# Altium schematic sheet Sheet1.SchDoc
size A4; SheetNumber: 1; SheetTotal: 1
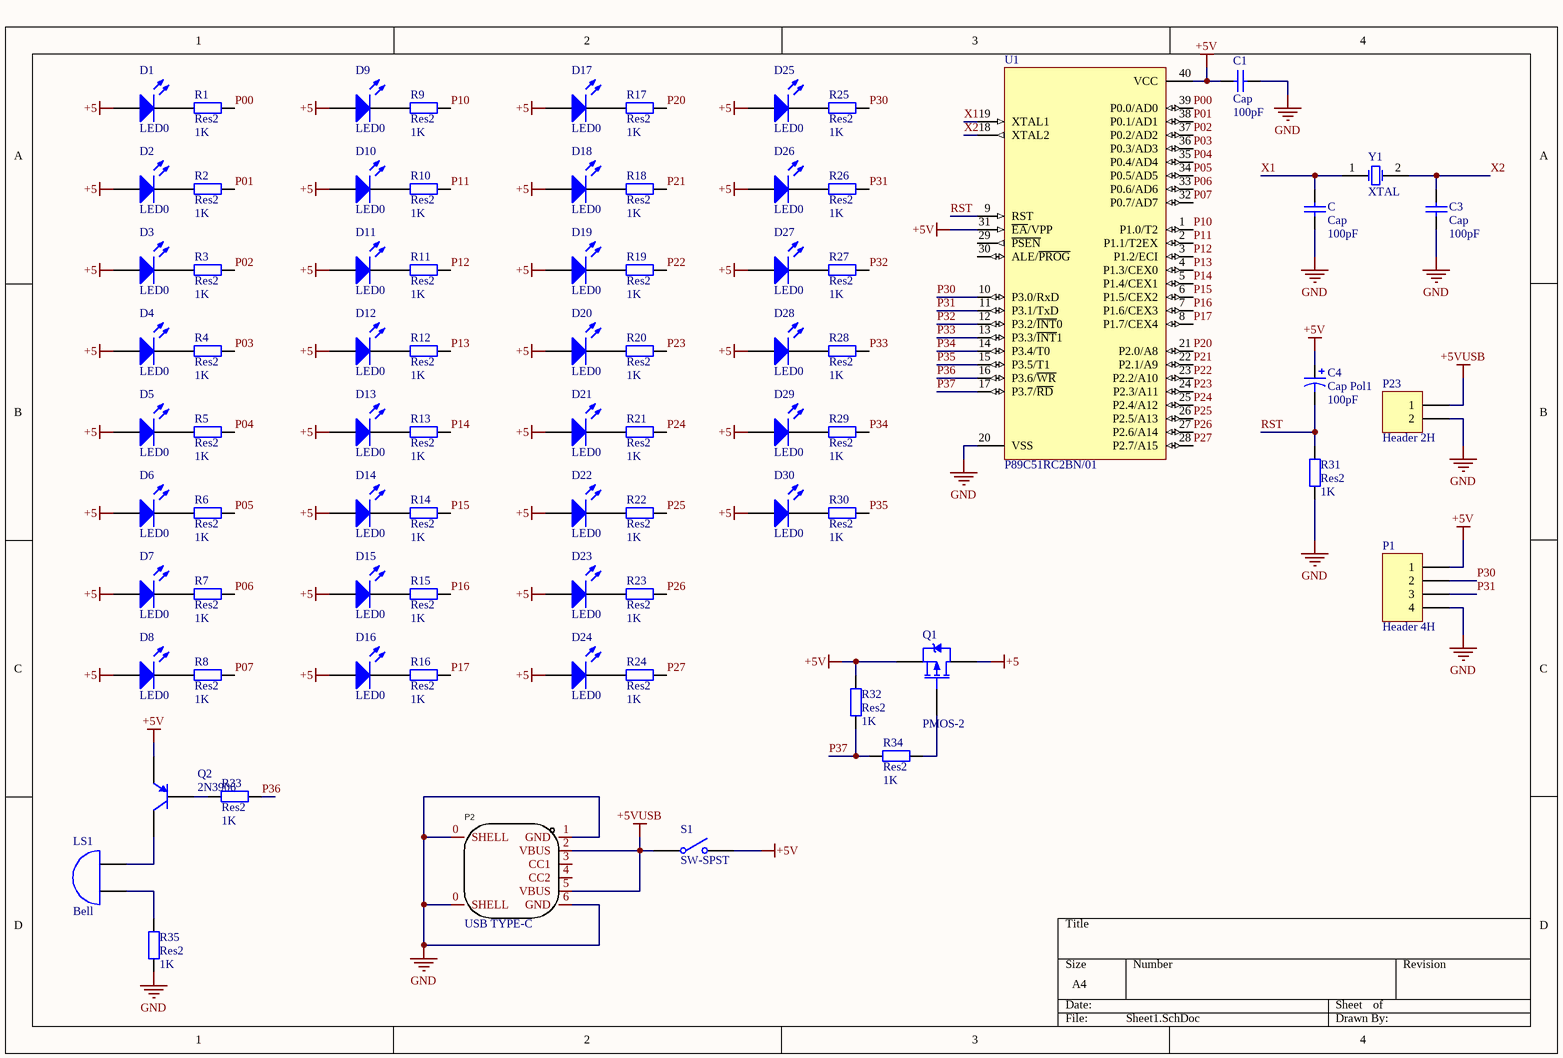
[diagram p0: Sheet1.SchDoc]

## Parts
C  Cap  value 100pF  [C-0.1]
C1  Cap  value 100pF  [C-0.1]
C3  Cap  value 100pF  [C-0.1]
C4  Cap Pol1  value 100pF  [CD-0.2T]
D1  LED0  [led5]
D2  LED0  [led5]
D3  LED0  [led5]
D4  LED0  [led5]
D5  LED0  [led5]
D6  LED0  [led5]
D7  LED0  [led5]
D8  LED0  [led5]
D9  LED0  [led5]
D10  LED0  [led5]
D11  LED0  [led5]
D12  LED0  [led5]
D13  LED0  [led5]
D14  LED0  [led5]
D15  LED0  [led5]
D16  LED0  [led5]
D17  LED0  [led5]
D18  LED0  [led5]
D19  LED0  [led5]
D20  LED0  [led5]
D21  LED0  [led5]
D22  LED0  [led5]
D23  LED0  [led5]
D24  LED0  [led5]
D25  LED0  [led5]
D26  LED0  [led5]
D27  LED0  [led5]
D28  LED0  [led5]
D29  LED0  [led5]
D30  LED0  [led5]
LS1  Bell  [PIN2]
P1  Header 4H  [SIP4]
P2  USB TYPE-C  [USBTYPEC6]
P23  Header 2H  [HDR1X2H]
Q1  PMOS-2  [sot23]
Q2  2N3906  [TO-92A]
R1  Res2  value 1K  [R-0.3]
R2  Res2  value 1K  [R-0.3]
R3  Res2  value 1K  [R-0.3]
R4  Res2  value 1K  [R-0.3]
R5  Res2  value 1K  [R-0.3]
R6  Res2  value 1K  [R-0.3]
R7  Res2  value 1K  [R-0.3]
R8  Res2  value 1K  [R-0.3]
R9  Res2  value 1K  [R-0.3]
R10  Res2  value 1K  [R-0.3]
R11  Res2  value 1K  [R-0.3]
R12  Res2  value 1K  [R-0.3]
R13  Res2  value 1K  [R-0.3]
R14  Res2  value 1K  [R-0.3]
R15  Res2  value 1K  [R-0.3]
R16  Res2  value 1K  [R-0.3]
R17  Res2  value 1K  [R-0.3]
R18  Res2  value 1K  [R-0.3]
R19  Res2  value 1K  [R-0.3]
R20  Res2  value 1K  [R-0.3]
R21  Res2  value 1K  [R-0.3]
R22  Res2  value 1K  [R-0.3]
R23  Res2  value 1K  [R-0.3]
R24  Res2  value 1K  [R-0.3]
R25  Res2  value 1K  [R-0.3]
R26  Res2  value 1K  [R-0.3]
R27  Res2  value 1K  [R-0.3]
R28  Res2  value 1K  [R-0.3]
R29  Res2  value 1K  [R-0.3]
R30  Res2  value 1K  [R-0.3]
R31  Res2  value 1K  [R-0.3]
R32  Res2  value 1K  [R-0.3]
R33  Res2  value 1K  [R-0.3]
R34  Res2  value 1K  [R-0.3]
R35  Res2  value 1K  [R-0.3]
S1  SW-SPST  [onoff]
U1  P89C51RC2BN/01  [DIP40]
Y1  XTAL  [jz]

## Nets
+5: D1.1(A) D2.1(A) D3.1(A) D4.1(A) D5.1(A) D6.1(A) D7.1(A) D8.1(A) D9.1(A) D10.1(A) D11.1(A) D12.1(A) D13.1(A) D14.1(A) D15.1(A) D16.1(A) D17.1(A) D18.1(A) D19.1(A) D20.1(A) D21.1(A) D22.1(A) D23.1(A) D24.1(A) D25.1(A) D26.1(A) D27.1(A) D28.1(A) D29.1(A) D30.1(A) Q1.3(D)
+5V: C1.1 C4.1 P1.1 Q1.2(S) Q2.1(E) R32.2 S1.2(NO) U1.31(~{EA}/VPP) U1.40(VCC)
+5VUSB: P2.2(VBUS) P2.5(VBUS) P23.1 S1.1(COMMON)
GND: C.1 C1.2 C3.1 P1.4 P2.0(SHELL) P2.1(GND) P2.6(GND) P23.2 R31.1 R35.1 U1.20(VSS)
P00: R1.2 U1.39(P0.0/AD0)
P01: R2.2 U1.38(P0.1/AD1)
P02: R3.2 U1.37(P0.2/AD2)
P03: R4.2 U1.36(P0.3/AD3)
P04: R5.2 U1.35(P0.4/AD4)
P05: R6.2 U1.34(P0.5/AD5)
P06: R7.2 U1.33(P0.6/AD6)
P07: R8.2 U1.32(P0.7/AD7)
P10: R9.2 U1.1(P1.0/T2)
P11: R10.2 U1.2(P1.1/T2EX)
P12: R11.2 U1.3(P1.2/ECI)
P13: R12.2 U1.4(P1.3/CEX0)
P14: R13.2 U1.5(P1.4/CEX1)
P15: R14.2 U1.6(P1.5/CEX2)
P16: R15.2 U1.7(P1.6/CEX3)
P17: R16.2 U1.8(P1.7/CEX4)
P20: R17.2 U1.21(P2.0/A8)
P21: R18.2 U1.22(P2.1/A9)
P22: R19.2 U1.23(P2.2/A10)
P23: R20.2 U1.24(P2.3/A11)
P24: R21.2 U1.25(P2.4/A12)
P25: R22.2 U1.26(P2.5/A13)
P26: R23.2 U1.27(P2.6/A14)
P27: R24.2 U1.28(P2.7/A15)
P30: P1.2 R25.2 U1.10(P3.0/RxD)
P31: P1.3 R26.2 U1.11(P3.1/TxD)
P32: R27.2 U1.12(P3.2/~{INT}0)
P33: R28.2 U1.13(P3.3/~{INT}1)
P34: R29.2 U1.14(P3.4/T0)
P35: R30.2 U1.15(P3.5/T1)
P36: R33.1 U1.16(P3.6/~{WR})
P37: R32.1 R34.2 U1.17(P3.7/~{RD})
RST: C4.2 R31.2 U1.9(RST)
X1: C.2 U1.19(XTAL1) Y1.1(OSC1)
X2: C3.2 U1.18(XTAL2) Y1.2(OSC2)
NetD1_2: D1.2(K) R1.1
NetD2_2: D2.2(K) R2.1
NetD3_2: D3.2(K) R3.1
NetD4_2: D4.2(K) R4.1
NetD5_2: D5.2(K) R5.1
NetD6_2: D6.2(K) R6.1
NetD7_2: D7.2(K) R7.1
NetD8_2: D8.2(K) R8.1
NetD9_2: D9.2(K) R9.1
NetD10_2: D10.2(K) R10.1
NetD11_2: D11.2(K) R11.1
NetD12_2: D12.2(K) R12.1
NetD13_2: D13.2(K) R13.1
NetD14_2: D14.2(K) R14.1
NetD15_2: D15.2(K) R15.1
NetD16_2: D16.2(K) R16.1
NetD17_2: D17.2(K) R17.1
NetD18_2: D18.2(K) R18.1
NetD19_2: D19.2(K) R19.1
NetD20_2: D20.2(K) R20.1
NetD21_2: D21.2(K) R21.1
NetD22_2: D22.2(K) R22.1
NetD23_2: D23.2(K) R23.1
NetD24_2: D24.2(K) R24.1
NetD25_2: D25.2(K) R25.1
NetD26_2: D26.2(K) R26.1
NetD27_2: D27.2(K) R27.1
NetD28_2: D28.2(K) R28.1
NetD29_2: D29.2(K) R29.1
NetD30_2: D30.2(K) R30.1
NetLS1_1: LS1.1(A) R35.2
NetLS1_2: LS1.2(B) Q2.3(C)
NetQ1_1: Q1.1(G) R34.1
NetQ2_2: Q2.2(B) R33.2

Not connected (* = marked no-connect by the designer): P2 3(CC1) 4(CC2); U1 29(~{PSEN}) 30(ALE/~{PROG})

## Library data of the parts
C C1 C3 = Cap: Capacitor; Published: 8-Jun-2000; LatestRevisionDate: 17-Jul-2002; LatestRevisionNote: Re-released for DXP Platform.; PackageReference: RAD-0.3; Publisher: Altium Limited; PackageDescription: Radial Cap, Thru-Hole; 2 Leads; 0.3 in Pin Spacing
C4 = Cap Pol1: Polarized Capacitor (Radial); Published: 8-Jun-2000; LatestRevisionDate: 17-Jul-2002; LatestRevisionNote: Re-released for DXP Platform.; PackageReference: RB7.6-15; Publisher: Altium Limited; PackageDescription: Polarized Capacitor (Radial); 2 Leads
D1-D30 = LED0: Typical INFRARED GaAs LED; Published: 8-Jun-2000; LatestRevisionDate: 08-Jul-2005; LatestRevisionNote: Mech Layer 1 removed.; PackageReference: LED-0; Publisher: Altium Limited; PackageDescription: LED; 2 Leads
LS1 = Bell: Electrical Bell; Published: 24-Mar-1999; LatestRevisionDate: 17-Jul-2002; LatestRevisionNote: Re-released for DXP Platform.; PackageReference: PIN2; Publisher: Altium Limited
P1 = Header 4H: Header, 4-Pin, Right Angle; LatestRevisionDate: 17-Jul-2002; LatestRevisionNote: Re-released for DXP Platform.; Publisher: Altium Limited
P2 = USB TYPE-C 6P: Symbol: TYPE-C 6P CB1.6(073); Add into BOM: yes; Number of Ports: 1; Number of Contacts: 6P; Current Rating - Power (Max): 5A; Device: TYPE-C 6P CB1.6(073); Supplier Part: C2858274; Manufacturer Part: TYPE-C 6P CB1.6(073); Supplier Footprint: SMD; JLCPCB Part Class: Extended Part; Datasheet: https://atta.szlcsc.com/upload/public/pdf/source/20220408/7E0E465C11F85B3C51A520D1219A5616.pdf; Supplier: LCSC; Convert to PCB: yes; Connector Type: Type-C; Standard: -
P23 = Header 2H: Header, 2-Pin, Right Angle; LatestRevisionDate: 17-Jul-2002; LatestRevisionNote: Re-released for DXP Platform.; Publisher: Altium Limited
Q1 = AO3401: P-Channel Power MOSFET; Note: Pin 4 not drawn and electrically connected to Pin 2.; Published: 8-Jun-2000; LatestRevisionDate: 17-Jul-2002; LatestRevisionNote: Re-released for DXP Platform.; DatasheetDocument: PD-9.390D; PackageReference: TO-220AB; Publisher: Altium Limited; Code_JEDEC: TO-220-AB; ComponentLink1Description: Manufacturer Link; ComponentLink1URL: http://www.irf.com/
Q2 = 2N3906: PNP General Purpose Amplifier; Published: 8-Jun-2000; LatestRevisionDate: 15-Jan-2003; LatestRevisionNote: PCB Footprint 'BCY-W3/D4.7' replaced; DatasheetVersion: 1997; PackageVersion: Sep-1998; PackageReference: TO-92A; Publisher: Altium Limited; PackageDescription: TO, Flat Index; 3 In-Line, Axial Leads; Body Dia. 4.5mm; Leads 0.51 x 0.48 mm (max); ComponentLink1Description: Manufacturer Link; ComponentLink1URL: http://www.fairchildsemi.com/; ComponentLink2Description: Datasheet; ComponentLink2URL: http://www.fairchildsemi.com/ds/2N%2F2N3906.pdf
R1-R35 = Res2: Resistor; Published: 8-Jun-2000; LatestRevisionDate: 17-Jul-2002; LatestRevisionNote: Re-released for DXP Platform.; PackageReference: AXIAL-0.4; Publisher: Altium Limited; PackageDescription: Axial Device, Thru-Hole; 2 Leads; 0.4 in Pin Spacing
S1 = SW-SPST: Single-Pole, Single-Throw Switch; Published: 24-Mar-1999; LatestRevisionDate: 17-Jul-2002; LatestRevisionNote: Re-released for DXP Platform.; PackageReference: SPST-2; Publisher: Altium Limited; PackageDescription: Switch; 2 Leads
U1 = P89C51RC2BN/01: 80C51 8-Bit Flash Microcontroller Family, 32 kB ISP/IAP Flash with 512 B RAM.; Published: 21-May-2003; DatasheetVersion: 18-Jul-2002; PackageVersion: Aug-2000; PackageReference: SOT129-1; Publisher: Altium Limited; PackageDescription: DIP, Plastic; 40 Leads; Row Spacing 15.24 mm; Pitch 2.54 mm; Code_JEDEC: MO-015; ComponentLink1Description: Manufacturer Link; ComponentLink1URL: http://www-us2.semiconductors.philips.com/; ComponentLink2Description: Datasheet; ComponentLink2URL: http://www.semiconductors.philips.com/acrobat/datasheets/P89C51RA2_RB2_RC2_RD2_2.pdf
Y1 = XTAL: Crystal Oscillator; Published: 8-Jun-2000; LatestRevisionDate: 17-Jul-2002; LatestRevisionNote: Re-released for DXP Platform.; PackageReference: R38; Publisher: Altium Limited; PackageDescription: Crystal, Thru-Hole; 2 Leads; Body 3.1 x 8.2 mm (Dia.xH)